# EAGLE design GeigerCounter (EAGLE 6.5.0)
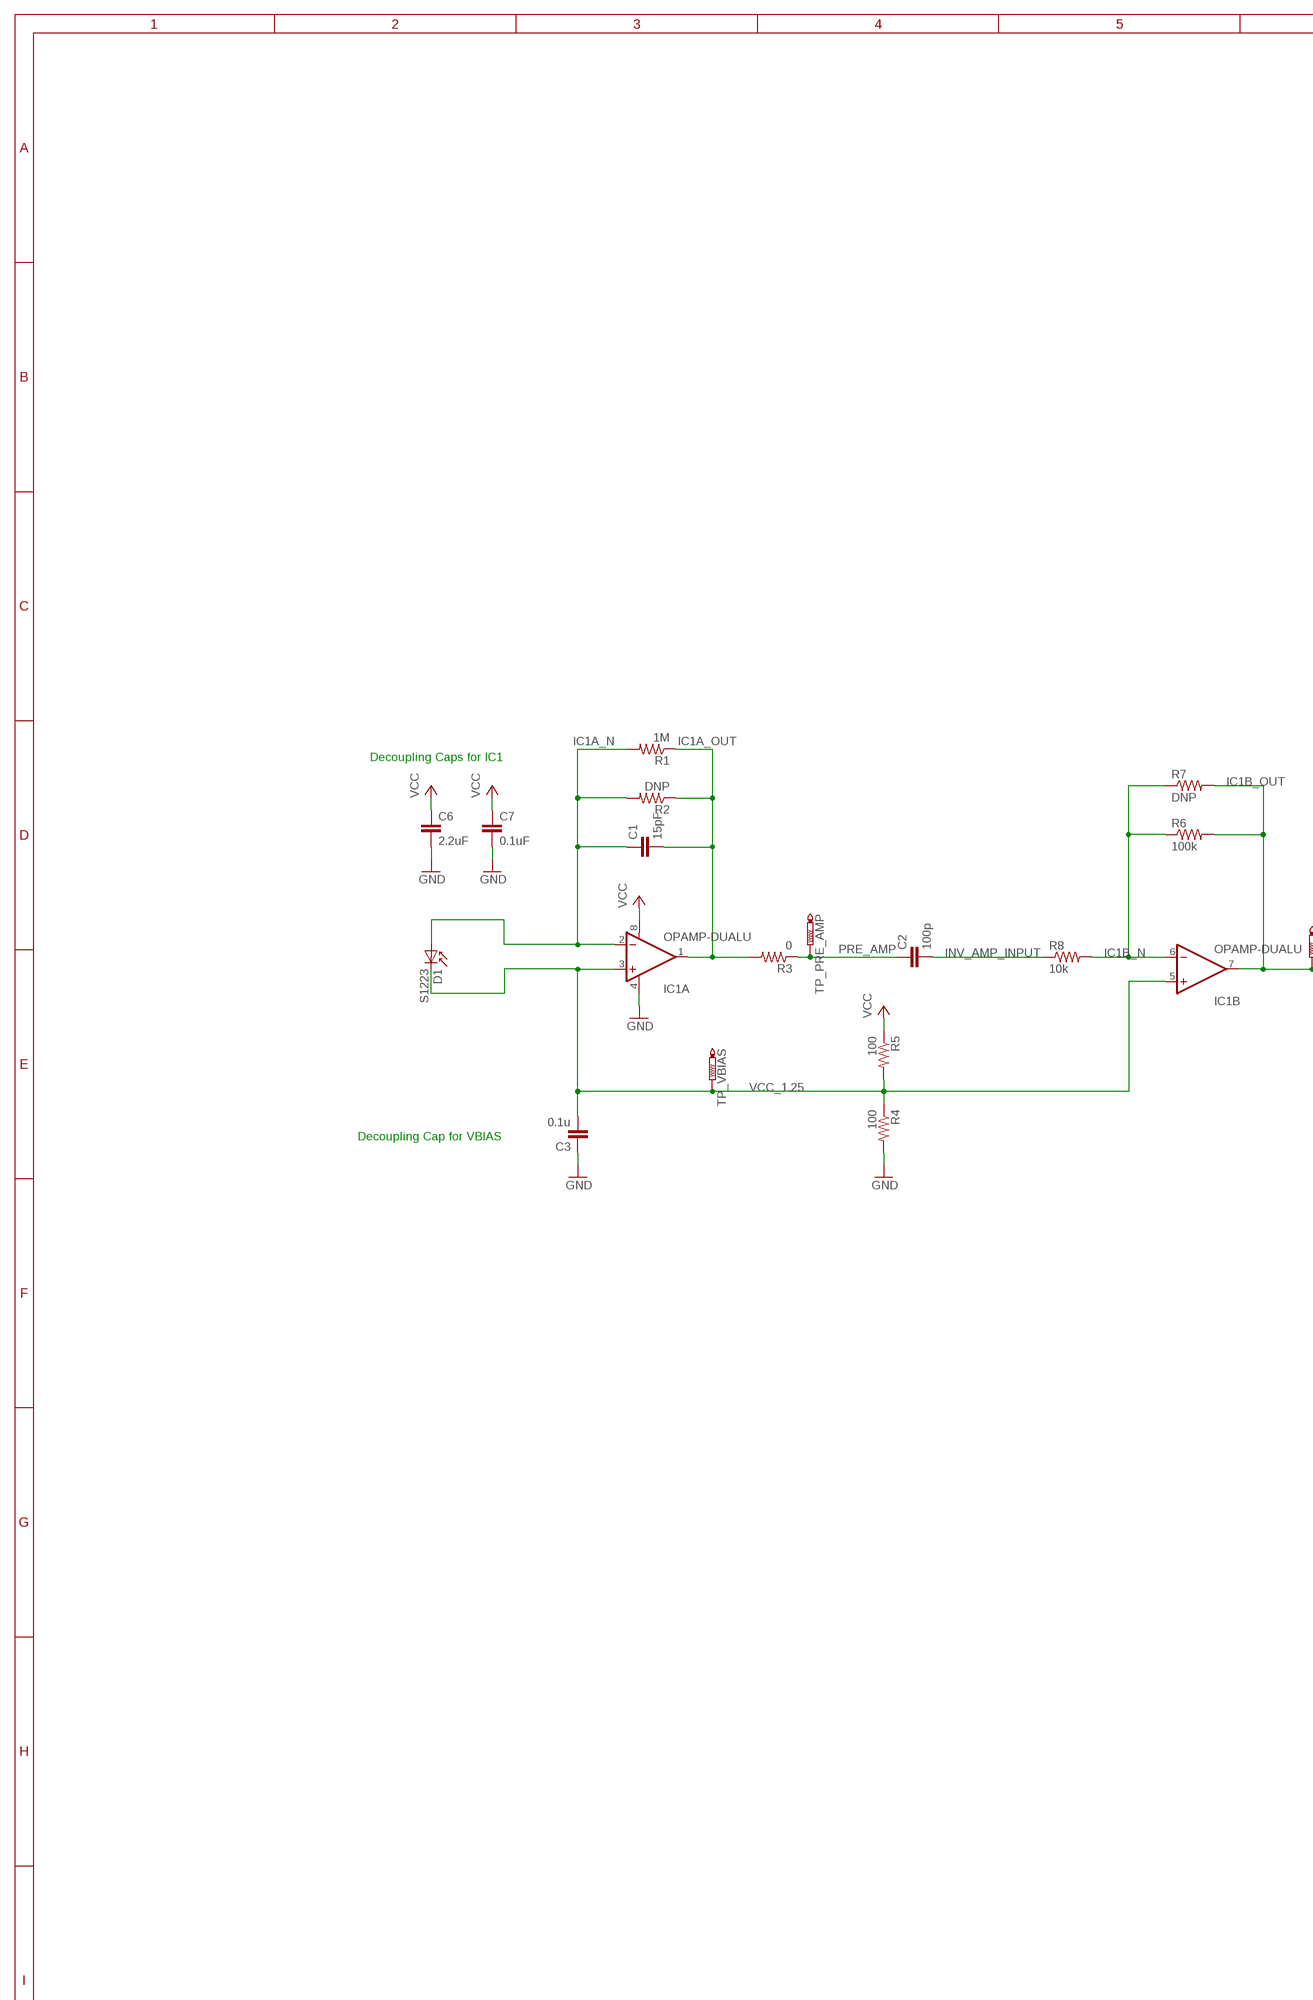
[diagram p0: schematic, sheet 1, part 1 of 2]
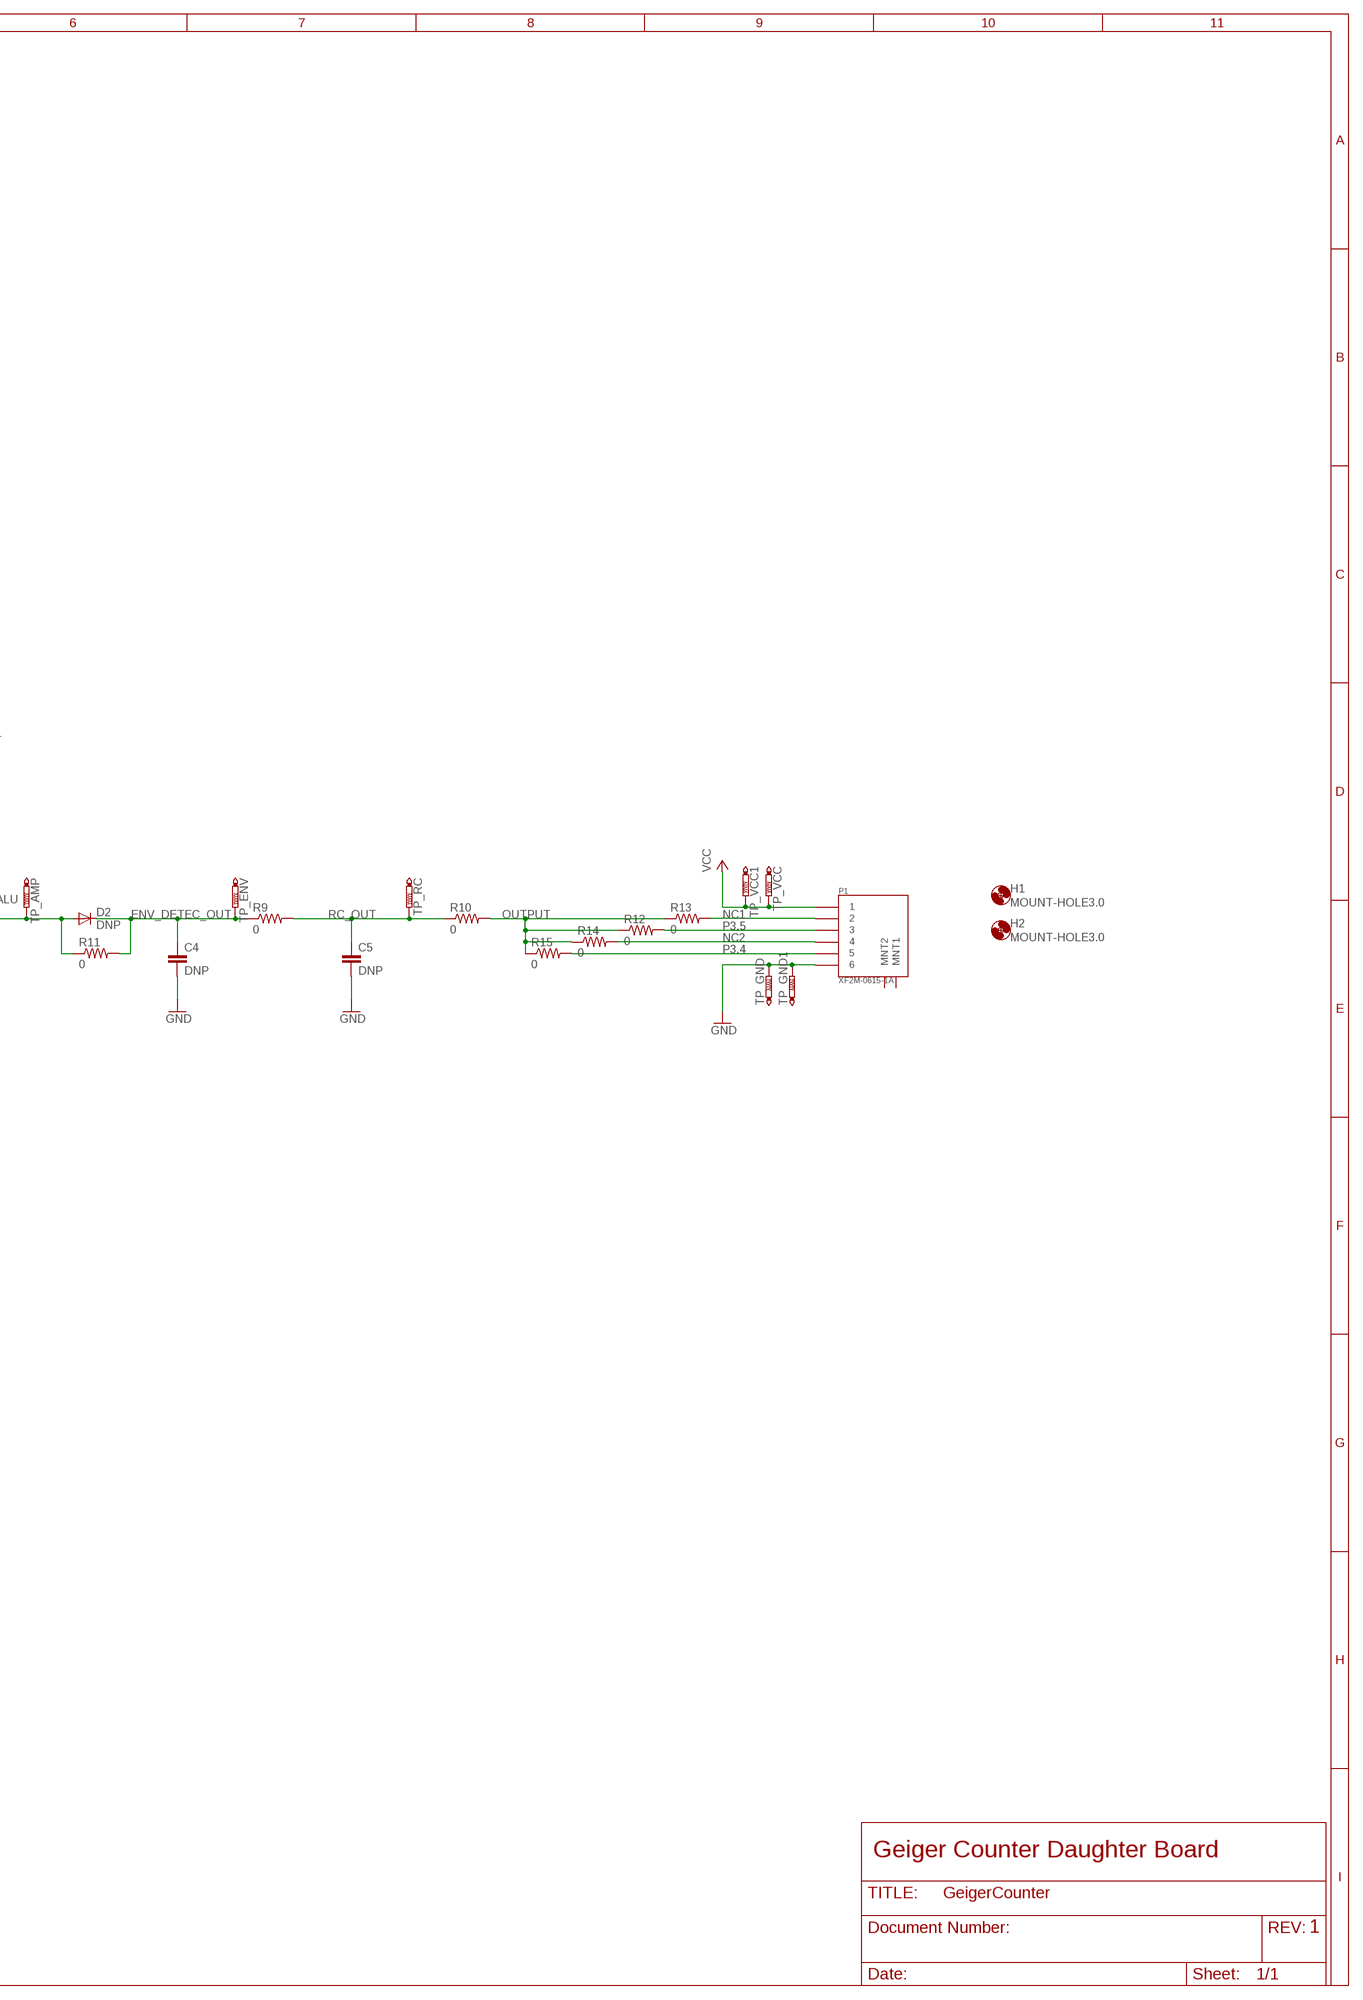
[diagram p1: schematic, sheet 1, part 2 of 2]

## Parts
C1  15pF  CAP0603-CAP  [0603-CAP]
C2  100p  CAP0603-CAP  [0603-CAP]
C3  0.1u  CAP0603-CAP  [0603-CAP]
C4  DNP  CAP0603-CAP  [0603-CAP]
C5  DNP  CAP0603-CAP  [0603-CAP]
C6  2.2uF  CAP0603-CAP  [0603-CAP]
C7  0.1uF  CAP0603-CAP  [0603-CAP]
D1  S1223  [DIODE-1N4001]
D2  DNP  DIODESOT23  [SOT23-3]
H1  MOUNT-HOLE3.0  [3,0]
H2  MOUNT-HOLE3.0  [3,0]
IC1  OPAMP-DUALU  [SO08]
P1  XF2M-0615-1A  [XF2M-0615-1A]
R1  1M  RESISTOR0603-RES  [0603-RES]
R2  DNP  RESISTOR0603-RES  [0603-RES]
R3  0  RESISTOR0603-RES  [0603-RES]
R4  100  RESISTOR0603-RES  [0603-RES]
R5  100  RESISTOR0603-RES  [0603-RES]
R6  100k  RESISTOR0603-RES  [0603-RES]
R7  DNP  RESISTOR0603-RES  [0603-RES]
R8  10k  RESISTOR0603-RES  [0603-RES]
R9  0  RESISTOR0603-RES  [0603-RES]
R10  0  RESISTOR0603-RES  [0603-RES]
R11  0  RESISTOR0603-RES  [0603-RES]
R12  0  RESISTOR0603-RES  [0603-RES]
R13  0  RESISTOR0603-RES  [0603-RES]
R14  0  RESISTOR0603-RES  [0603-RES]
R15  0  RESISTOR0603-RES  [0603-RES]
TP_AMP  PTR1PAD1-20  [P1-20]
TP_ENV  PTR1PAD1-20  [P1-20]
TP_GND  PTR1PAD1-20  [P1-20]
TP_GND1  PTR1PAD1-20  [P1-20]
TP_PRE_AMP  PTR1PAD1-20  [P1-20]
TP_RC  PTR1PAD1-20  [P1-20]
TP_VBIAS  PTR1PAD1-20  [P1-20]
TP_VCC  PTR1PAD1-20  [P1-20]
TP_VCC1  PTR1PAD1-20  [P1-20]

## Nets
ENV_DETEC_OUT: C4.1 D2.3(C) R9.1 R11.2 TP_ENV.TP
GND: C3.1 C4.2 C5.2 C6.2 C7.2 IC1.4(A:V-) P1.6 R4.2 TP_GND1.TP TP_GND.TP
IC1A_N: C1.1 D1.A IC1.2(A:-IN) R1.2 R2.2
IC1A_OUT: C1.2 IC1.1(A:OUT) R1.1 R2.1 R3.2
IC1B_N: IC1.6(B:-IN) R6.1 R7.1 R8.2
IC1B_OUT: D2.1(A) IC1.7(B:OUT) R6.2 R7.2 R11.1 TP_AMP.TP
INV_AMP_INPUT: C2.2 R8.1
NC1: P1.2 R13.2
NC2: P1.4 R14.2
OUTPUT: R10.2 R12.1 R13.1 R14.1 R15.1
P3.4: P1.5 R15.2
P3.5: P1.3 R12.2
PRE_AMP: C2.1 R3.1 TP_PRE_AMP.TP
RC_OUT: C5.1 R9.2 R10.1 TP_RC.TP
VCC: C6.1 C7.1 IC1.8(A:V+) P1.1 R5.1 TP_VCC1.TP TP_VCC.TP
VCC_1.25: C3.2 D1.C IC1.3(A:+IN) IC1.5(B:+IN) R4.1 R5.2 TP_VBIAS.TP
Unconnected: P1.P$7(MNT1) P1.P$8(MNT2)

## Notes on the sheet
- Decoupling Caps for IC1
- Decoupling Cap for VBIAS
- Geiger Counter Daughter Board
- 1

## Library data of the parts
C1-C7 = SparkFun-Passives:CAP: Capacitor Standard 0603 ceramic capacitor, and 0.1" leaded capacitor.
D1 = GeigerCounter:S1223: S1223 PIN Photodiode
D2 = SparkFun-DiscreteSemi:DIODE: Diode These are standard reverse protection diodes and small signal diodes. SMA package can handle up to about 1A. SOD-323 can handle about 200mA. What the SOD-323 package when ordering, there are some mfgs out there that are 5-pin packages.
H1 H2 = holes:MOUNT-HOLE: MOUNTING HOLE with drill center marker
IC1 = SparkFun-AnalogIC:OPAMP-DUAL: Generic op-amp footprint
P1 = GeigerCounter:XF2M-0615-1A: XF2M-0615-1A
R1-R15 = SparkFun-Passives:RESISTOR: Resistor Basic schematic elements and footprints for 0603, 1206, and PTH resistors.
TP_AMP TP_ENV TP_GND TP_GND1 TP_PRE_AMP TP_RC TP_VBIAS TP_VCC TP_VCC1 = testpad:PTR1: TEST PIN

## Board
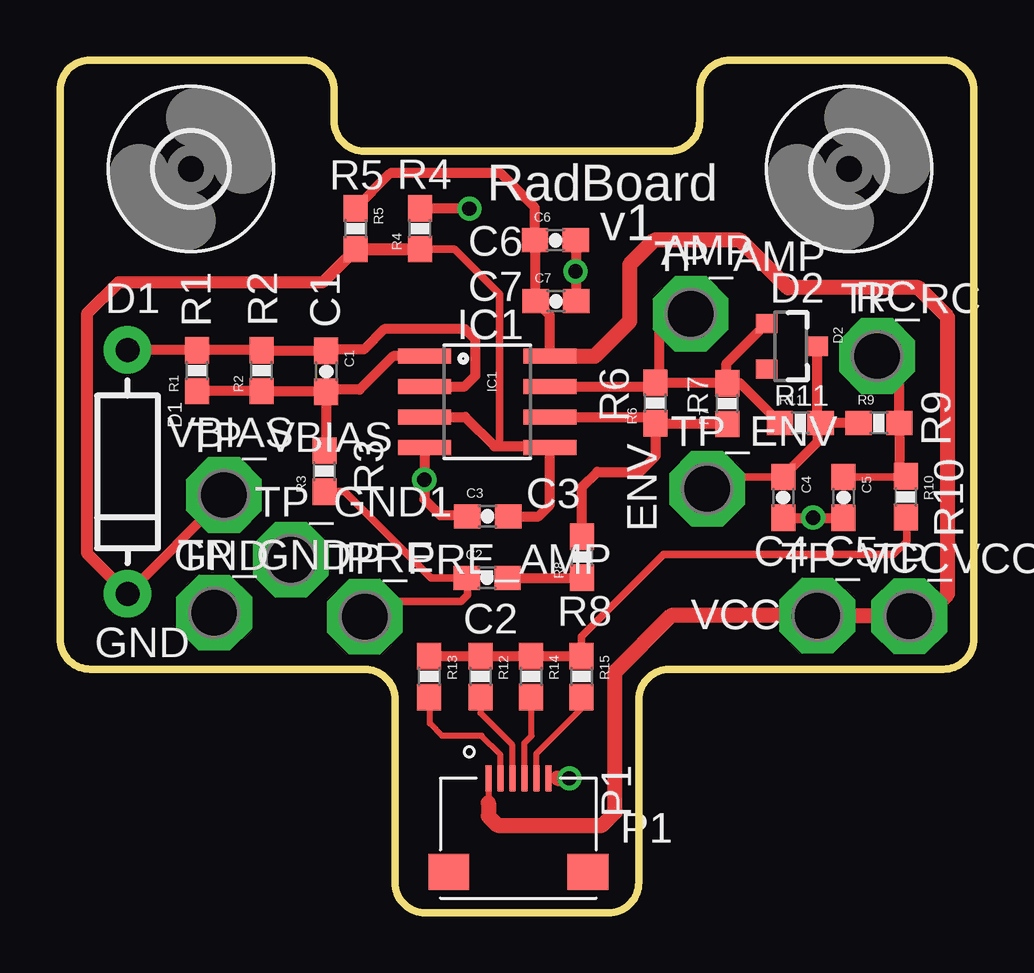
[diagram p2: board, top side]
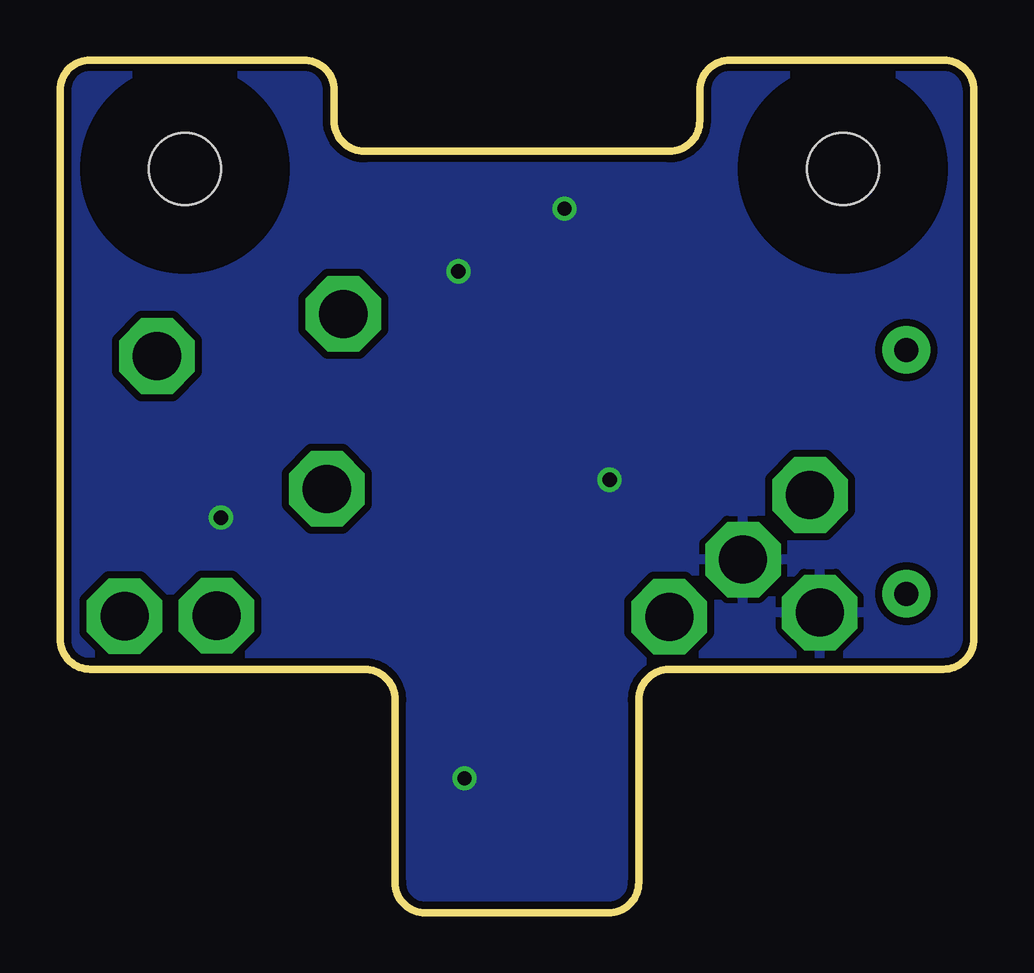
[diagram p3: board, bottom side, seen from below]

Size 38.1 x 35.56 mm. Coordinates in mm from the lower left corner, seen from the top.
Outline: 38.1,34.29 38.1,11.43 arc-90 36.83,10.16 25.4,10.16 arc90 24.13,8.89 24.13,1.27 arc-90 22.86,0 15.24,0 arc-90 13.97,1.27 13.97,8.89 arc90 12.7,10.16 1.27,10.16 arc-90 0,11.43 0,34.29 arc-90 1.27,35.56 10.16,35.56 arc-90 11.43,34.29 11.43,33.02 arc90 12.7,31.75 25.4,31.75 arc90 26.67,33.02 26.67,34.29 arc-90 27.94,35.56 36.83,35.56 arc-90 38.1,34.29
Copper layers (1*16): Top 0.035mm / dielectric 1.5mm / Bottom 0.035mm
Design rules "default *": minimum track width 9mil, minimum drill 23mil, track to track 8mil, track to pad 8mil, pad to pad 8mil, via to via 8mil, smd to smd 8mil, copper to edge 10mil, drill to drill 8mil, minimum pad ring 10mil, minimum via ring 8mil, stop-mask expansion 0mil, vias tented up to drill 0mil, thermal gap 10mil

### Footprints (pad centres in the part's own frame; a part is rotated, then mirrored left to right if it is on the bottom)
0603-CAP = smd 1.1 x 1: 1 -0.85,0; 2 0.85,0
DIODE-1N4001 = drill 1 pad 1.981: A -5.08,0; C 5.08,0
SOT23-3 = smd 0.8 x 0.9: 1 -0.95,-1; 2 0.95,-1; 3 0,1.1
3,0 = hole 3: 0,0
SO08 = smd 0.61 x 2.21: 1 -1.905,-2.616; 2 -0.635,-2.616; 3 0.635,-2.616; 4 1.905,-2.616; 5 1.905,2.616; 6 0.635,2.616; 7 -0.635,2.616; 8 -1.905,2.616
XF2M-0615-1A = smd 0.25 x 1.1: 1 -1.27,2.54; 2 -0.77,2.54; 3 -0.27,2.54; 4 0.23,2.54; 5 0.73,2.54; 6 1.23,2.54 | smd 1.7 x 1.5: P$7 2.88,-1.36; P$8 -2.92,-1.36
0603-RES = smd 1.1 x 1: 1 -0.85,0; 2 0.85,0
P1-20 = drill 2.007 pad 3.15 octagon: TP 0,0

### Placement (x,y rotation side)
C1  11.1,22.58 270 top
C2  17.81,13.97 0 top
C3  17.83,16.54 0 top
C4  30.15,17.32 270 top
C5  32.66,17.32 270 top
C6  20.65,28.04 0 top
C7  20.68,25.5 0 top
D1  2.82,18.39 270 top
D2  30.45,23.62 270 top
H1  5.46,31.01 0 top
H2  32.89,31.01 0 top
IC1  17.81,21.31 270 top
P1  19.13,3.07 0 top
R1  5.71,22.61 90 top
R2  8.41,22.61 90 top
R3  11.02,18.42 90 top
R4  15.01,28.52 90 top
R5  12.32,28.52 270 top
R6  24.82,21.26 90 top
R7  27.81,21.23 90 top
R8  21.77,14.83 90 top
R9  34.14,20.42 0 top
R10  35.26,17.35 270 top
R11  30.86,20.42 0 top
R12  17.53,9.86 270 top
R13  15.39,9.86 270 top
R14  19.63,9.86 270 top
R15  21.74,9.86 270 top
TP_AMP  26.29,24.97 0 top
TP_ENV  26.97,17.68 0 top
TP_GND  6.43,12.52 0 top
TP_GND1  9.63,14.73 0 top
TP_PRE_AMP  12.7,12.34 0 top
TP_RC  34.06,23.22 0 top
TP_VBIAS  6.83,17.42 0 top
TP_VCC  31.57,12.4 0 top
TP_VCC1  35.41,12.37 0 top

### Tracks (layer width: path | path; a pad name or v marks a point on that pad's centre or on a via)
ENV_DETEC_OUT
  Top 0.305: TP_ENV.TP 27.47,18.17 C4.1
  Top 0.406: D2.3 31.55,20.58 R11.2 | R9.1 R11.2 | C4.1 30.15,18.21 31.6,19.66 31.6,20.31 R11.2
GND  (via drill 0.6)
  Top 0.254: P1.6 20.73,5.61
  Top 0.406: IC1.4 v15.19,18.06 15.19,17.25 15.85,16.59 16.93,16.59 C3.1 | C7.2 21.53,26.71 v21.49,26.75 21.5,26.76 C6.2 | v31.39,16.48 31.38,16.47 C4.2 C5.2 | R4.2 v17.06,29.37 v17.07,29.36
  Top 0.635: 20.73,5.61 v21.23,5.61 21.26,5.61
  pour Bottom (isolate 0.305): 0,11.43 0,34.29 arc-90 1.27,35.56 10.16,35.56 arc-90 11.43,34.29 11.43,33.02 arc90 12.7,31.75 25.4,31.75 arc90 26.67,33.02 26.67,34.29 arc-90 27.94,35.56 36.83,35.56 arc-90 38.1,34.29 38.1,11.43 arc-90 36.83,10.16 25.4,10.16 arc90 24.13,8.89 24.13,1.27 arc-90 22.86,0 15.24,0 arc-90 13.97,1.27 13.97,8.89 arc90 12.7,10.16 1.27,10.16 arc-90
IC1A_N
  Top 0.305: D1.A
  Top 0.406: IC1.2 16.87,21.95 17.32,22.4 17.32,23.9 16.89,24.33 13.51,24.33 12.67,23.49 11.1,23.49 C1.1 8.41,23.43 R2.2 R1.2 D1.A
IC1A_OUT
  Top 0.406: C1.2 11.1,19.34 R3.2 | IC1.1 13.89,23.22 12.5,21.82 11.19,21.82 C1.2 | C1.2 8.43,21.73 R2.1 R1.1
IC1B_N
  Top 0.406: IC1.6 24.55,20.68 R6.1 | R6.1 27.79,20.41 R7.1 | R8.2 21.77,17.75 22.4,18.39 24.18,18.39 24.84,19.05 24.84,20.38 R6.1
IC1B_OUT
  Top 0.406: IC1.7 24.65,21.95 R6.2 | R6.2 27.79,22.11 | 27.79,22.11 R7.2 28.35,22.08 R11.1 | 27.79,22.11 27.79,22.9 D2.1 | TP_AMP.TP 25.55,24.97 24.97,24.38 24.97,22.26 R6.2
INV_AMP_INPUT
  Top 0.406: C2.2 21.75,13.97 R8.1
NC1
  Top 0.254: P1.2 18.36,6.61 17.58,7.39 15.93,7.39 15.42,7.9 15.42,8.98 R13.2
NC2
  Top 0.254: P1.4 19.36,7.09 19.66,7.39 19.66,8.98 R14.2
OUTPUT
  Top 0.305: R10.2 35.31,16.45 35.31,15.49 34.75,14.93 25.15,14.93 21.74,11.53 R15.1
  Top 0.406: R15.1 R14.1 R12.1 R13.1
P3.4
  Top 0.254: P1.5 19.86,6.65 21.74,8.53 R15.2
P3.5
  Top 0.254: R12.2 17.53,8.33 18.86,7 P1.3
PRE_AMP
  Top 0.305: R3.1 11.87,17.56 15.47,13.97 C2.1 16.99,13.93 16.99,13.26 16.71,12.98 13.34,12.98 TP_PRE_AMP.TP
RC_OUT
  Top 0.305: C5.1 35.23,18.17 R10.1
  Top 0.406: R10.1 34.99,18.47 R9.2 34.99,22.29 TP_RC.TP
VCC
  Top 0.254: P1.1 17.86,4.6
  Top 0.406: IC1.8 20.42,24.91 C7.1 19.83,28.02 C6.1 19.8,29.4 18.36,30.84 13.77,30.84 12.32,29.39 R5.1
  Top 0.635: 17.86,4.6 17.86,4.04 18.24,3.66 22.61,3.66 23.14,4.19 23.14,10.06 25.48,12.39 TP_VCC.TP | TP_VCC.TP 35.38,12.39 TP_VCC1.TP | TP_VCC.TP 36.09,12.39 37.01,13.31 37.01,24.84 35.79,26.06 30.35,26.06 28.37,28.04 24.77,28.04 23.75,27.03 23.75,24.66 22.3,23.22 IC1.8
VCC_1.25
  Top 0.305: R4.1 16.45,27.67 18.31,25.81 18.31,19.53 18.39,19.46 | TP_VBIAS.TP 6.83,17.32
  Top 0.406: C3.2 19.94,16.54 20.42,17.02 IC1.5 20.37,19.46 18.39,19.46 18.11,19.46 16.89,20.68 IC1.3 | 6.83,17.32 D1.C
  Top 0.508: D1.C 1.12,15.01 1.12,24.97 2.44,26.29 10.95,26.29 12.32,27.66 R5.2 R4.1

### Text on the board
Dimension: This layer is the board outline | Please use the dark outline as the board outline | Please use all standard spec for this 2 layer board | If problems arise during fabrication, please call, anytime day or night: | John O'Hollaren | 541-508-8501
tPlace: R5 | R4 | RadBoard | v1 | C6 | AMP | C7 | D2 | RC | D1 | R1 | R2 | C1 | IC1 | R11 | R6 | R7 | VBIAS | R9 | R3 | C3 | ENV | R10 | GND | PRE | C4 | C5 | C2 | R8 | VCC | GND | P1